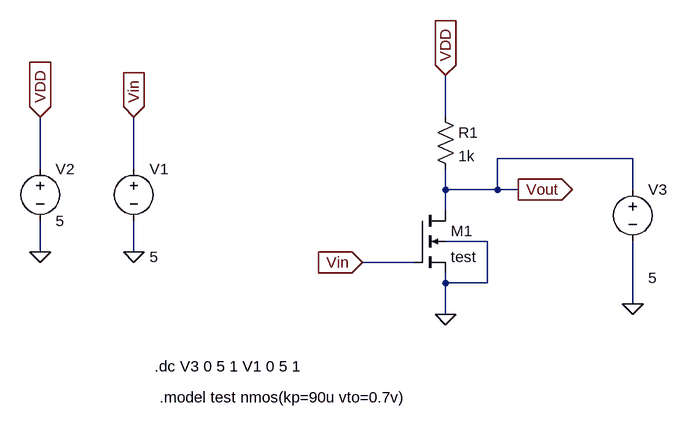
[diagram p0: schematic CS_RdLOADLINE.asc]
CS_RdLOADLINE.asc, the LTspice schematic file:
Version 4
SHEET 1 996 680
WIRE 624 16 624 -48
WIRE 912 80 704 80
WIRE 0 96 0 16
WIRE 144 96 144 16
WIRE 624 128 624 96
WIRE 704 128 704 80
WIRE 704 128 624 128
WIRE 736 128 704 128
WIRE 912 128 912 80
WIRE 624 160 624 128
WIRE 688 208 624 208
WIRE 0 224 0 176
WIRE 144 224 144 176
WIRE 576 240 496 240
WIRE 624 272 624 256
WIRE 688 272 688 208
WIRE 688 272 624 272
WIRE 912 304 912 208
WIRE 624 320 624 272
FLAG 0 224 0
FLAG 144 224 0
FLAG 624 320 0
FLAG 0 16 VDD
IOPIN 0 16 In
FLAG 624 -48 VDD
IOPIN 624 -48 In
FLAG 736 128 Vout
IOPIN 736 128 Out
FLAG 144 16 Vin
IOPIN 144 16 In
FLAG 496 240 Vin
IOPIN 496 240 In
FLAG 912 304 0
SYMBOL voltage 144 80 R0
WINDOW 3 24 152 Left 2
WINDOW 123 24 124 Left 2
WINDOW 39 0 0 Left 0
SYMATTR InstName V1
SYMATTR Value 5
SYMBOL voltage 0 80 R0
WINDOW 123 0 0 Left 0
WINDOW 39 0 0 Left 0
SYMATTR InstName V2
SYMATTR Value 5
SYMBOL nmos4 576 160 R0
SYMATTR InstName M1
SYMATTR Value test
SYMATTR Value2 l=1u w=3u
SYMBOL res 608 0 R0
SYMATTR InstName R1
SYMATTR Value 1k
SYMBOL voltage 912 112 R0
WINDOW 3 24 152 Left 2
WINDOW 123 24 124 Left 2
WINDOW 39 0 0 Left 0
SYMATTR InstName V3
SYMATTR Value 5
TEXT 176 400 Left 2 !.dc V3 0 5 1 V1 0 5 1
TEXT 184 448 Left 2 !.model test nmos(kp=90u vto=0.7v)

The netlist it stands for:
* CS_RdLOADLINE.asc
V1 Vin 0 5
V2 VDD 0 5
M1 Vout Vin 0 0 test l=1u w=3u
R1 VDD Vout 1k
V3 Vout 0 5
.model NMOS NMOS
.model PMOS PMOS
.lib standard.mos
.dc V3 0 5 1 V1 0 5 1
.model test nmos(kp=90u vto=0.7v)
.backanno
.end